# Altium schematic sheet [03] POWER.SchDoc: Template
size A4; Author: Hom; CompanyName: KitSprout; DrawnBy: Hom; Engineer: Hom; Organization: KitSprout; Revision: A; SheetNumber: 3; SheetTotal: 7; Version: 0.0; LibVersion: 0.0
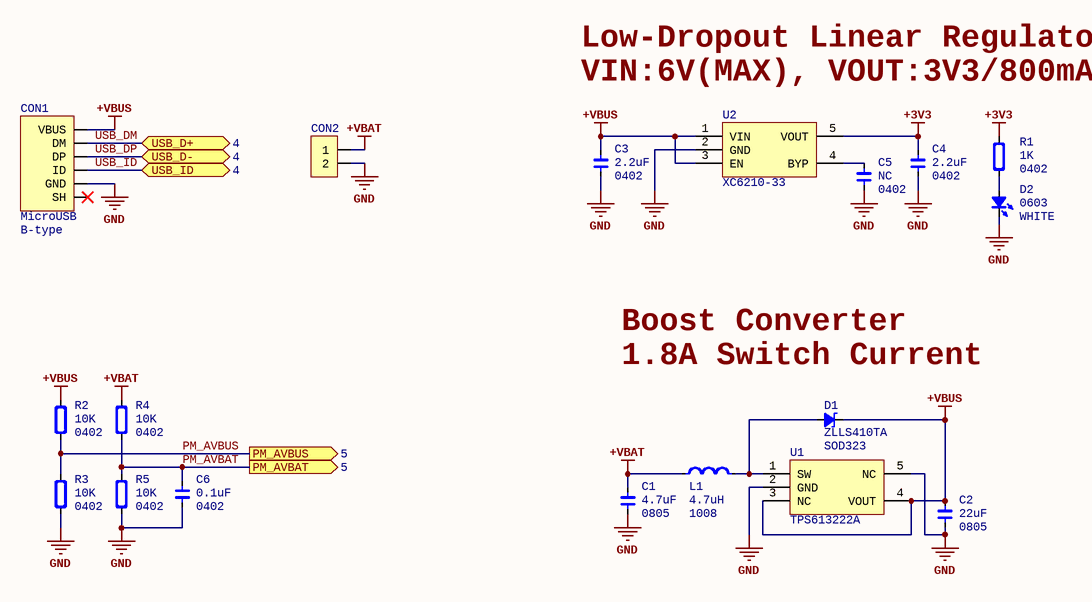
[diagram p0: [03] POWER.SchDoc]

## Parts
C1  value 4.7uF  Type: 0805  [CAP_0805]  (hidden comment: C0805)
C2  value 22uF  Type: 0805  [CAP_0805]  (hidden comment: C0805)
C3  value 2.2uF  Type: 0402  [CAP_0402]  (hidden comment: C0402)
C4  value 2.2uF  Type: 0402  [CAP_0402]  (hidden comment: C0402)
C5  value NC  Type: 0402  [CAP_0402]  (hidden comment: C0402)
C6  value 0.1uF  Type: 0402  [CAP_0402]  (hidden comment: C0402)
CON1  MicroUSB  Type: B-type  [USB_Micro-AB]
CON2  MX1.25_2P  [MX1.25_S90_2P]  (value not drawn)
D1  Type: SOD323  [SOD-323]  (hidden comment: ZLLS410TA)
D2  Type: 0603  [LED_0603_YELLOW]  (hidden comment: WHITE)
L1  value 4.7uH  Type: 1008  [IND_1008]  (hidden comment: H1008)
R1  value 1K  Type: 0402  [RES_0402]  (hidden comment: R0402)
R2  value 10K  Type: 0402  [RES_0402]  (hidden comment: R0402)
R3  value 10K  Type: 0402  [RES_0402]  (hidden comment: R0402)
R4  value 10K  Type: 0402  [RES_0402]  (hidden comment: R0402)
R5  value 10K  Type: 0402  [RES_0402]  (hidden comment: R0402)
U1  TPS613222A  [SOT23-5]
U2  XC6210-33  [SOT23-5]

## Ports
PM_AVBAT (out, see 5), PM_AVBUS (out, see 5), USB_D+ (bidir, see 4), USB_D- (bidir, see 4), USB_ID (bidir, see 4)

## Nets
+3V3: C4.2 R1.2 U2.5(VOUT)
+VBAT: C1.2 CON2.1 L1.1 R4.2
+VBUS: C2.2 C3.2 CON1.1(VBUS) D1.2(K) R2.2 U1.3(NC) U1.4(VOUT) U2.1(VIN) U2.3(EN)
GND: C1.1 C2.1 C3.1 C4.1 C5.1 C6.1 CON1.5(GND) CON2.2 D2.2(K) R3.1 R5.1 U1.2(GND) U1.5(NC) U2.2(GND)
PM_AVBAT: C6.2 R4.1 R5.2 ; port PM_AVBAT
PM_AVBUS: R2.1 R3.2 ; port PM_AVBUS
USB_DM: CON1.2(DM) ; port USB_D+
USB_DP: CON1.3(DP) ; port USB_D-
USB_ID: CON1.4(ID) ; port USB_ID
NetC5_2: C5.2 U2.4(BYP)
NetD1_1: D1.1(A) L1.2 U1.1(SW)
NetD2_1: D2.1(A) R1.1

Not connected (* = marked no-connect by the designer): CON1 0(SH)*

## Notes on the sheet
- Low-Dropout Linear Regulator
- VIN:6V(MAX), VOUT:3V3/800mA
- Boost Converter
- (near D1) 1.8A Switch Current

## Library data of the parts
C1 C2 = Cap_0805: Capacitor; Specification: X7R 50V; Manufacturer: *
C3-C6 = Cap_0402: Capacitor; Specification: X7R 50V; Manufacturer: *
CON1 = USB_Micro: USB
CON2 = MX1.25_2P: MX
D1 = SchottkyDiode_SOD323: Schottky Diode; Value: ZLLS410TA
D2 = LED_0603: LED; Value: WHITE
L1 = Ind_1008: Inductor; Specification: ±5% 100mA; Manufacturer: *
R1-R5 = Res_0402: Resistor; Specification: ±5%; Manufacturer: *
U1 = TPS61322xx: Power; Value: 5V; Type: SOT23-5
U2 = RT9193: Power; Value: 3V3; Type: SOT23-5